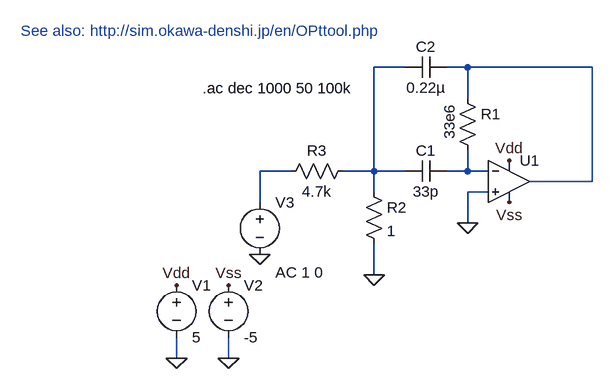
[diagram p0: schematic active_bandpass.asc]
active_bandpass.asc, the LTspice schematic file:
Version 4
SHEET 1 880 680
WIRE 96 -16 48 -16
WIRE 192 -16 160 -16
WIRE 384 -16 192 -16
WIRE 192 32 192 -16
WIRE -80 144 -128 144
WIRE 48 144 48 -16
WIRE 48 144 0 144
WIRE 96 144 48 144
WIRE 192 144 192 112
WIRE 192 144 160 144
WIRE 224 144 192 144
WIRE 384 160 384 -16
WIRE 384 160 288 160
WIRE 48 176 48 144
WIRE 224 176 192 176
WIRE -128 192 -128 144
WIRE 192 224 192 176
WIRE 48 304 48 256
WIRE -256 432 -256 400
WIRE -176 432 -176 400
FLAG -256 432 0
FLAG -176 432 0
FLAG -256 320 Vdd
FLAG -176 320 Vss
FLAG 256 128 Vdd
FLAG 256 192 Vss
FLAG 192 224 0
FLAG 48 304 0
FLAG -128 272 0
SYMBOL Opamps\\UniversalOpamp2 256 160 R0
SYMATTR InstName U1
SYMBOL voltage -256 304 R0
WINDOW 123 0 0 Left 0
WINDOW 39 0 0 Left 0
SYMATTR InstName V1
SYMATTR Value 5
SYMBOL voltage -176 304 R0
WINDOW 123 0 0 Left 0
WINDOW 39 0 0 Left 0
SYMATTR InstName V2
SYMATTR Value -5
SYMBOL cap 160 128 R90
WINDOW 0 0 32 VBottom 2
WINDOW 3 32 32 VTop 2
SYMATTR InstName C1
SYMATTR Value 33p
SYMBOL res 176 16 R0
WINDOW 3 -12 25 VRight 2
SYMATTR InstName R1
SYMATTR Value 33e6
SYMBOL cap 160 -32 R90
WINDOW 0 0 32 VBottom 2
WINDOW 3 32 32 VTop 2
SYMATTR InstName C2
SYMATTR Value 0.22µ
SYMBOL res 32 160 R0
SYMATTR InstName R2
SYMATTR Value 1
SYMBOL res 16 128 R90
WINDOW 0 0 56 VBottom 2
WINDOW 3 32 56 VTop 2
SYMATTR InstName R3
SYMATTR Value 4.7k
SYMBOL voltage -128 176 R0
WINDOW 123 24 124 Left 2
WINDOW 39 0 0 Left 0
SYMATTR InstName V3
SYMATTR Value ""
SYMATTR Value2 AC 1 0
TEXT -216 16 Left 2 !.ac dec 1000 50 100k
TEXT -496 -72 Left 2 ;See also: http://sim.okawa-denshi.jp/en/OPttool.php

The netlist it stands for:
* active_bandpass.asc
XU1 0 N004 Vdd Vss N002 level.2 Avol=1Meg GBW=10Meg Slew=10Meg ilimit=25m rail=0 Vos=0 phimargin=45 en=0 enk=0 in=0 ink=0 Rin=500Meg  ; pins IN+ IN- V+ V- OUT
V1 Vdd 0 5
V2 Vss 0 -5
C1 N004 N001 33p
R1 N002 N004 33e6
C2 N002 N001 0.22µ
R2 N001 0 1
R3 N001 N003 4.7k
V3 N003 0 AC 1 0
.ac dec 1000 50 100k
* See also: http://sim.okawa-denshi.jp/en/OPttool.php
.lib UniversalOpamps2.sub
.backanno
.end